# EAGLE schematic shift register paralel (EAGLE 6.4)
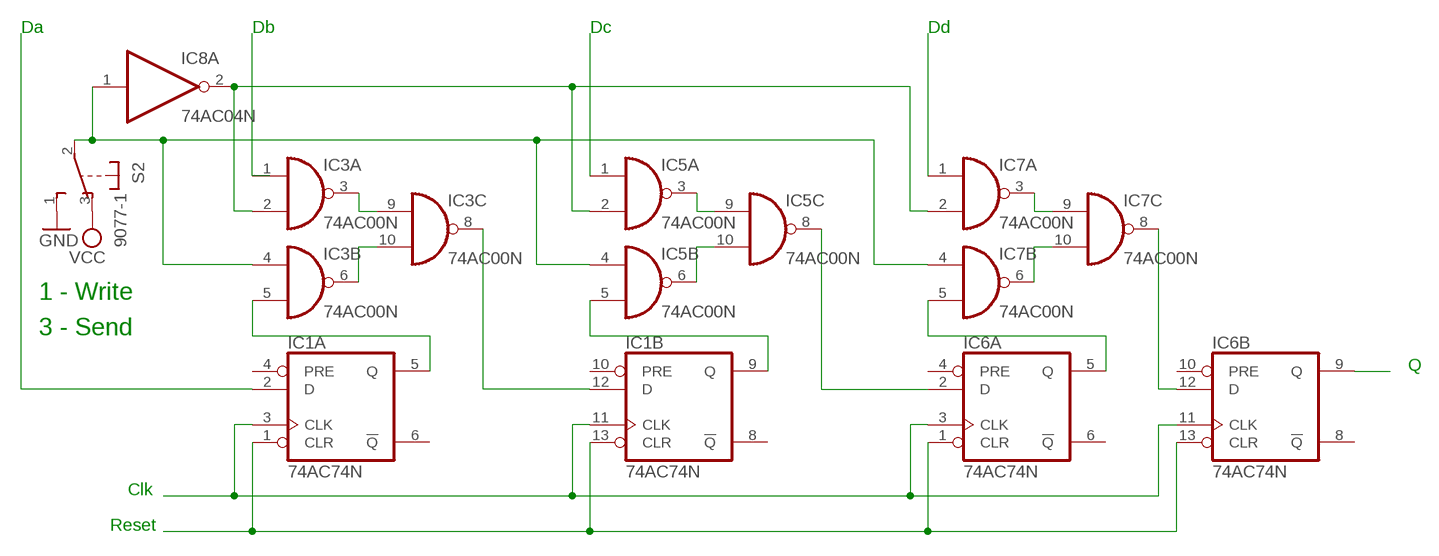
[diagram p0: schematic, sheet 1]

## Parts
IC1  74AC74N  [DIL14]
IC3  74AC00N  [DIL14]
IC5  74AC00N  [DIL14]
IC6  74AC74N  [DIL14]
IC7  74AC00N  [DIL14]
IC8  74AC04N  [DIL14]
S2  9077-1  [9077-1]

## Nets
GND: S2.1(S)
N$1: IC1.5(A:Q) IC3.5(B:I1)
N$2: IC3.6(B:O) IC3.10(C:I1)
N$3: IC3.3(A:O) IC3.9(C:I0)
N$4: IC1.9(B:Q) IC5.5(B:I1)
N$5: IC5.6(B:O) IC5.10(C:I1)
N$6: IC5.3(A:O) IC5.9(C:I0)
N$7: IC1.1(A:CLR) IC1.13(B:CLR) IC6.1(A:CLR) IC6.13(B:CLR)
N$8: IC6.5(A:Q) IC7.5(B:I1)
N$9: IC7.6(B:O) IC7.10(C:I1)
N$10: IC7.3(A:O) IC7.9(C:I0)
N$11: IC1.12(B:D) IC3.8(C:O)
N$12: IC5.8(C:O) IC6.2(A:D)
N$13: IC3.4(B:I0) IC5.4(B:I0) IC7.4(B:I0) IC8.1(A:I) S2.2(P)
N$14: IC5.1(A:I0)
N$15: IC3.2(A:I1) IC5.2(A:I1) IC7.2(A:I1) IC8.2(A:O)
N$16: IC7.1(A:I0)
N$17: IC1.2(A:D)
N$18: IC6.12(B:D) IC7.8(C:O)
N$19: IC6.9(B:Q)
N$20: IC1.3(A:CLK) IC1.11(B:CLK) IC6.3(A:CLK) IC6.11(B:CLK)
VCC: S2.3(O)
Unconnected: IC1.4(A:PRE) IC1.6(A:!Q) IC1.8(B:!Q) IC1.10(B:PRE) IC3.1(A:I0) IC3.11(D:O) IC3.12(D:I0) IC3.13(D:I1) IC5.11(D:O) IC5.12(D:I0) IC5.13(D:I1) IC6.4(A:PRE) IC6.6(A:!Q) IC6.8(B:!Q) IC6.10(B:PRE) IC7.11(D:O) IC7.12(D:I0) IC7.13(D:I1) IC8.3(B:I) IC8.4(B:O) IC8.5(C:I) IC8.6(C:O) IC8.8(D:O) IC8.9(D:I) IC8.10(E:O) IC8.11(E:I) IC8.12(F:O) IC8.13(F:I)

## Notes on the sheet
- Da | Db | Dc | Dd
- 1 - Write
- 3 - Send
- Q
- Clk
- Reset

## Power pins joined to a net without a drawn wire
GND: IC1.7(P:GND) IC3.7(P:GND) IC5.7(P:GND) IC6.7(P:GND) IC7.7(P:GND) IC8.7(P:GND)
VCC: IC1.14(P:VCC) IC3.14(P:VCC) IC5.14(P:VCC) IC6.14(P:VCC) IC7.14(P:VCC) IC8.14(P:VCC)

## Library data of the parts
IC1 IC6 = 74xx-eu:74*74: Dual D type positive edge triggered FLIP FLOP, preset and clear
IC3 IC5 IC7 = 74xx-eu:74*00: Quad 2-input NAND gate
IC8 = 74xx-eu:74*04: Hex INVERTER
S2 = switch-misc:9077-1: MARQUARDT SWITCH 9077.0100 Distributor: Buerklin <https://www.buerklin.com/default.asp?event=ShowArtikel%2812G2820%29&l=d&jump=ArtNr_12G2820>